# EasyEDA schematic Schematic_DeLonghi_CP_structured.json
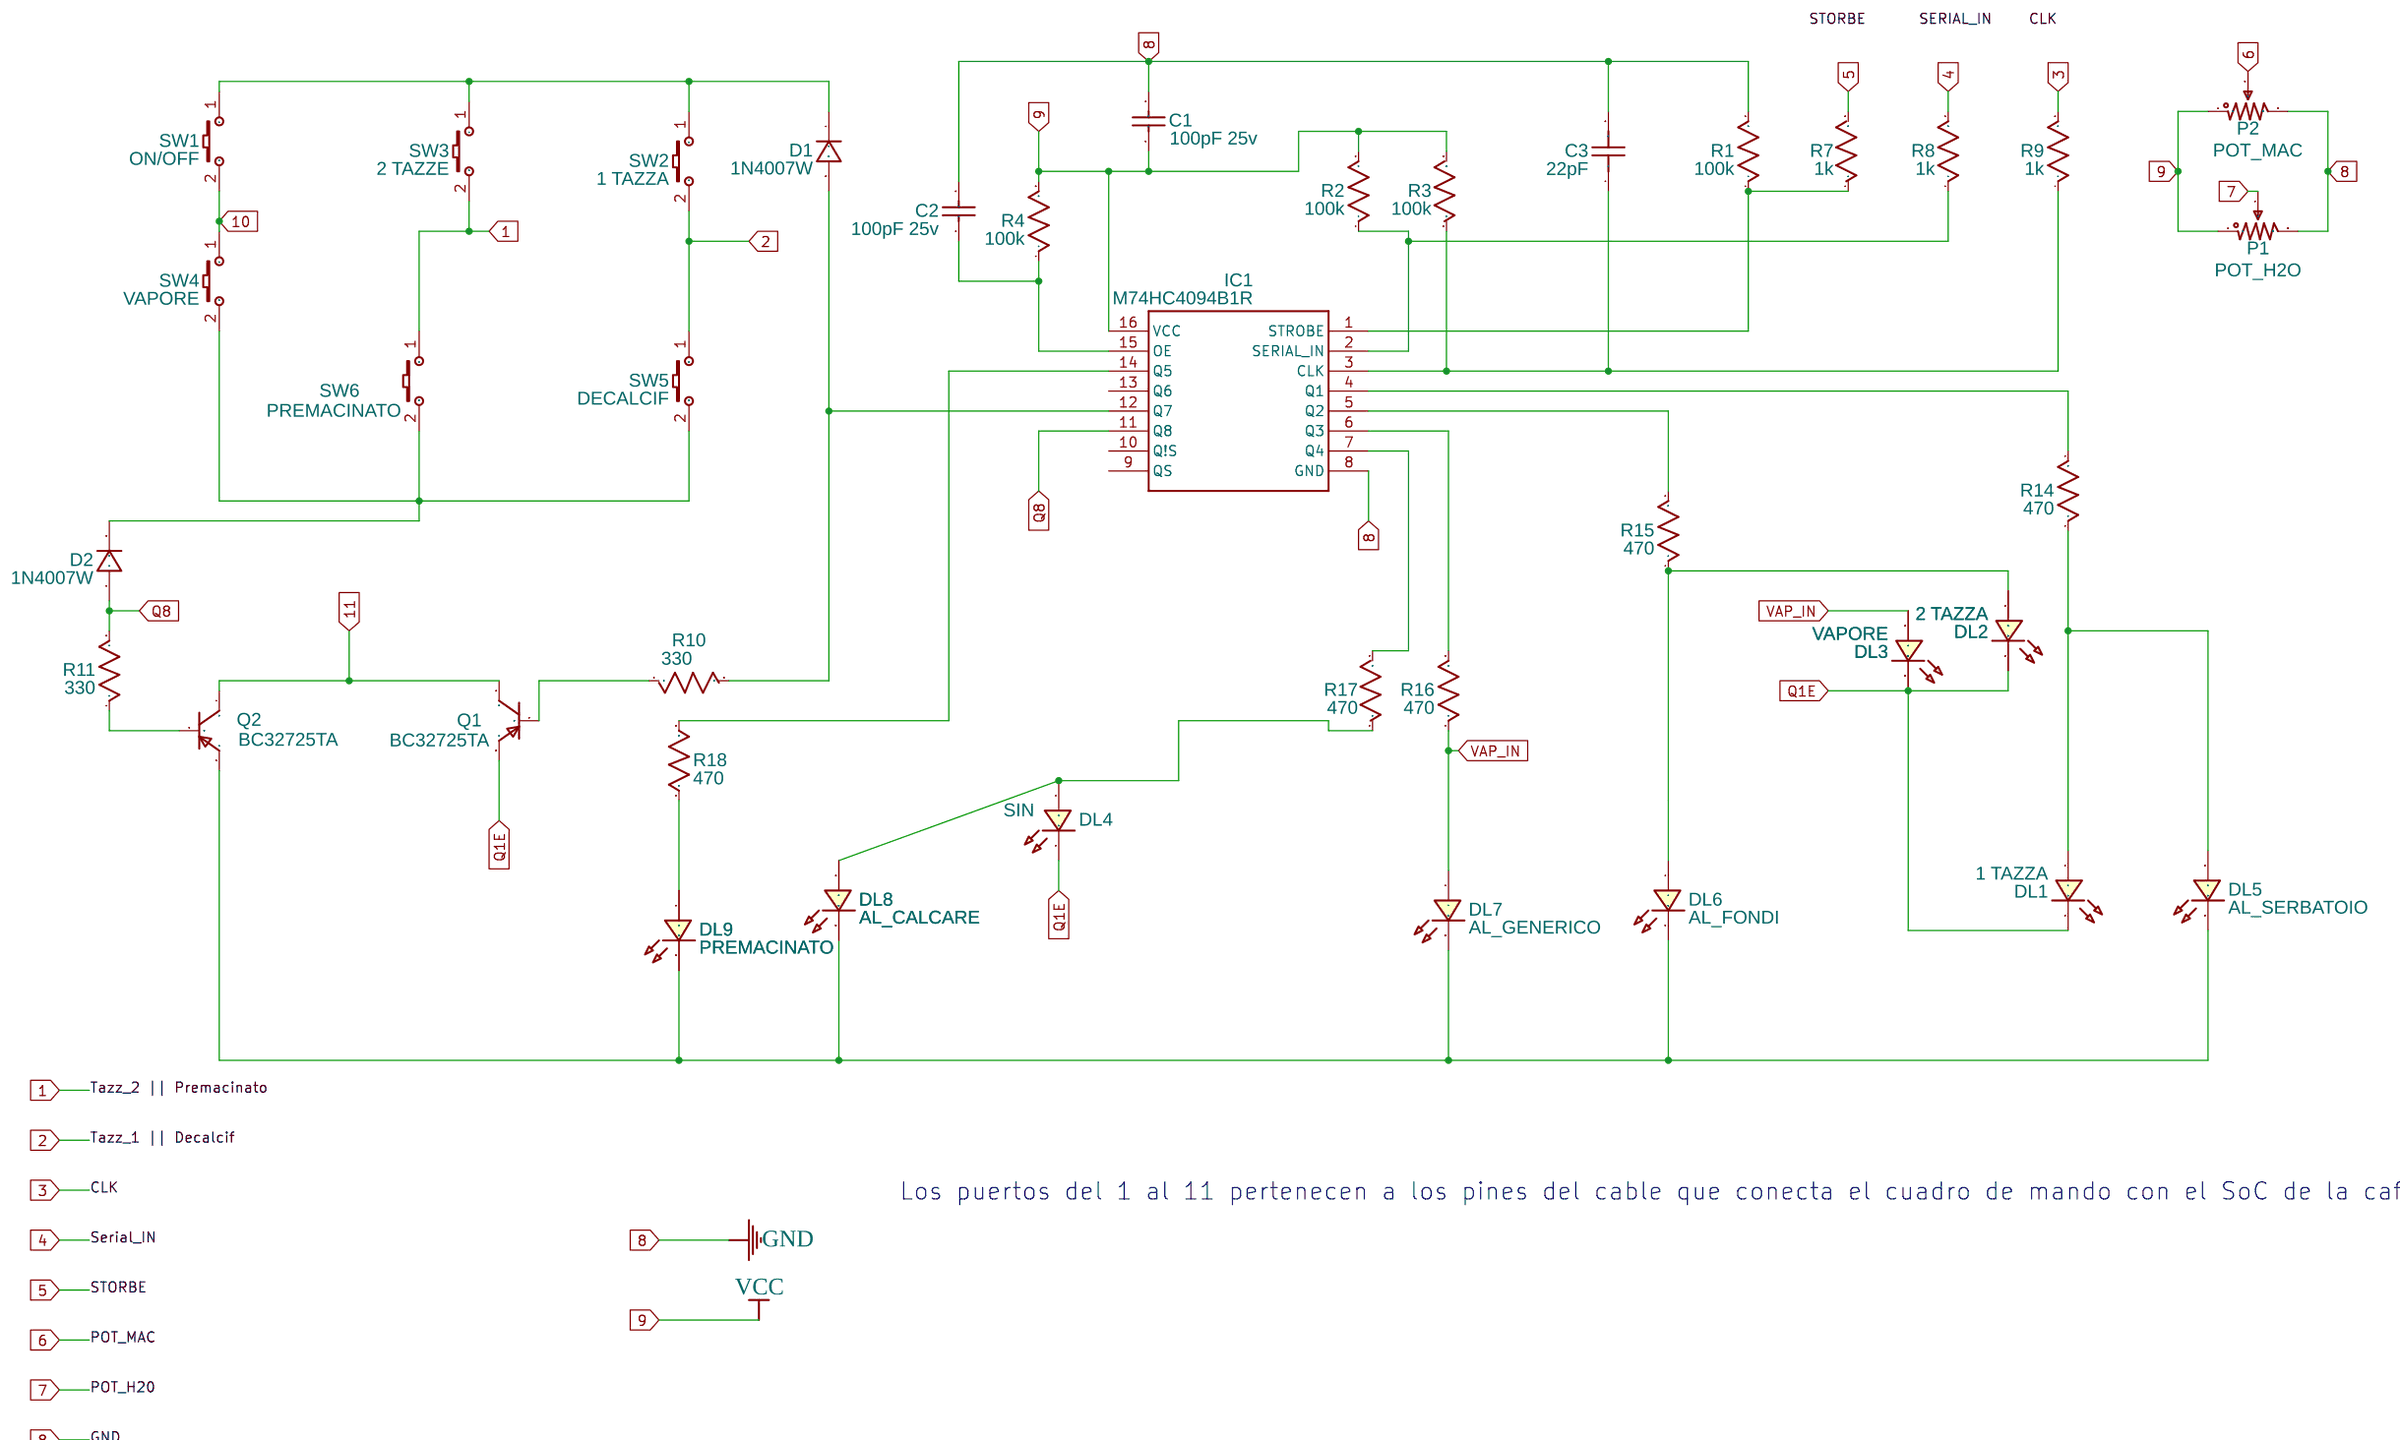
[diagram p0: schematic sheet]

## Parts
C1  100pF 25v  [100PF/25V]
C2  100pF 25v  [100PF/25V]
C3  22pF  [C0805]
D1  1N4007W  [SOD-123_L2.8-W1.8-LS3.7-RD]
D2  1N4007W  [SOD-123_L2.8-W1.8-LS3.7-RD]
DL1  1 TAZZA  [LED0603_RED]
DL2  2 TAZZA  [LED0603_RED]
DL3  VAPORE  [LED0603_RED]
DL4  SIN  [LED0603_RED]
DL5  AL_SERBATOIO  [LED0603_RED]
DL6  AL_FONDI  [LED0603_RED]
DL7  AL_GENERICO  [LED0603_RED]
DL8  AL_CALCARE  [LED0603_RED]
DL9  PREMACINATO  [LED0603_RED]
IC1  M74HC4094B1R  [DIP780W50P254L2000H510Q16N]
P1  POT_H2O  [RES-ADJ-TH_3386P]
P2  POT_MAC  [RES-ADJ-TH_3386P]
Q1  BC32725TA  [TO-92-3_L4.8-W3.7-P2.54-L]
Q2  BC32725TA  [TO-92-3_L4.8-W3.7-P2.54-L]
R1  100k  [R0201]
R2  100k  [R0201]
R3  100k  [R0201]
R4  100k  [R0201]
R7  1k  [R0201]
R8  1k  [R0201]
R9  1k  [R0201]
R10  330  [R0201]
R11  330  [R0201]
R14  470  [R0201]
R15  470  [R0201]
R16  470  [R0201]
R17  470  [R0201]
R18  470  [R0201]
SW1  ON/OFF  [KEY-SMD_2P-L6.2-W3.6-LS8.0]
SW2  1 TAZZA  [KEY-SMD_2P-L6.2-W3.6-LS8.0]
SW3  2 TAZZE  [KEY-SMD_2P-L6.2-W3.6-LS8.0]
SW4  VAPORE  [KEY-SMD_2P-L6.2-W3.6-LS8.0]
SW5  DECALCIF  [KEY-SMD_2P-L6.2-W3.6-LS8.0]
SW6  PREMACINATO  [KEY-SMD_2P-L6.2-W3.6-LS8.0]

## Library data of the parts
C1 C2 = 100pF (101) 25V: Contributor: dr.alex
C3 = 08051A220JAT2A: Supplier: LCSC; Supplier Part: C382073; Manufacturer: AVX; Contributor: LCSC
D1 D2 = 1N4007W: Supplier: LCSC; Supplier Part: C328592; Manufacturer: BLUE ROCKET; Contributor: LCEDA_Lib
DL1-DL9 = LED-0603_R: Manufacturer: EVERLIGHT(台湾亿光); Manufacturer Part: 19-217/R6C-AL1M2VY/3T; Supplier Part: C72044; Supplier: LCSC; Contributor: LCEDA_01
IC1 = M74HC4094B1R
P1 = R_3386P_US: Supplier: LCSC; Contributor: LCEDA_Lib; value(Ω): 2.5K
P2 = R_3386P_US: Supplier: LCSC; Contributor: LCEDA_Lib; value(Ω): 10K
Q1 Q2 = BC32725TA: Supplier: LCSC; Supplier Part: C236948; Manufacturer: ON Semicon; Contributor: LCSC
R1-R4 R7-R11 R14-R18 = R_0201_US: Contributor: LCEDA_Lib
SW1-SW6 = K2-3.6×6.1_SMD: Supplier Part: C118141; Supplier: LCSC; Manufacturer Part: K2-1107ST-A4SW-06; Contributor: LCEDA_Lib; 制造商: 韩国韩荣

## Nets
1: SW3.2 SW6.1
2: SW2.2 SW5.1
3: R9.2
4: R8.2
5: R7.2
6: P2.2
7: P1.2
8: C1.1 C2.2 C3.2 IC1.8(GND) P1.3 P2.3 R1.2
9: C1.2 IC1.16(VCC) P1.1 P2.1 R2.2 R3.2 R4.2
10: SW1.2 SW4.1
11: Q1.1(C) Q2.1(C)
Q1E: DL1.2 DL2.2 DL3.2 DL4.2 Q1.3(E)
Q8: D2.2 IC1.11(Q8) R11.2
VAP_IN: DL3.1 DL7.1 R16.1
Net-(C2-1): C2.1 IC1.15(OE) R4.1
Net-(C3-1): C3.1 IC1.3(CLK) R3.1 R9.1
Net-(D1-1): D1.1 SW1.1 SW2.1 SW3.1
Net-(D1-2): D1.2 IC1.12(Q7) R10.2
Net-(D2-1): D2.1 SW4.2 SW5.2 SW6.2
Net-(DL1-1): DL1.1 DL5.1 R14.1
Net-(DL2-1): DL2.1 DL6.1 R15.1
Net-(DL4-1): DL4.1 DL8.1 R17.1
Net-(DL5-2): DL5.2 DL6.2 DL7.2 DL8.2 DL9.2 Q2.3(E)
Net-(DL9-1): DL9.1 R18.1
Net-(IC1-1): IC1.1(STROBE) R1.1 R7.1
Net-(IC1-2): IC1.2(SERIAL_IN) R2.1 R8.1
Net-(IC1-4): IC1.4(Q1) R14.2
Net-(IC1-5): IC1.5(Q2) R15.2
Net-(IC1-6): IC1.6(Q3) R16.2
Net-(IC1-7): IC1.7(Q4) R17.2
Net-(IC1-14): IC1.14(Q5) R18.2
Net-(Q1-2): Q1.2(B) R10.1
Net-(Q2-2): Q2.2(B) R11.1

Not connected (* = marked no-connect by the designer): IC1 9(QS) 10(Q!S) 13(Q6)

## Notes on the sheet
- Esquemático del cuadro de mandos de la cafetera Delonghi ESAM 4000
- Los puertos del 1 al 11 pertenecen a los pines del cable que conecta el cuadro de mando con el SoC de la cafetera
